# EAGLE design usbtin (EAGLE 9.4.2)
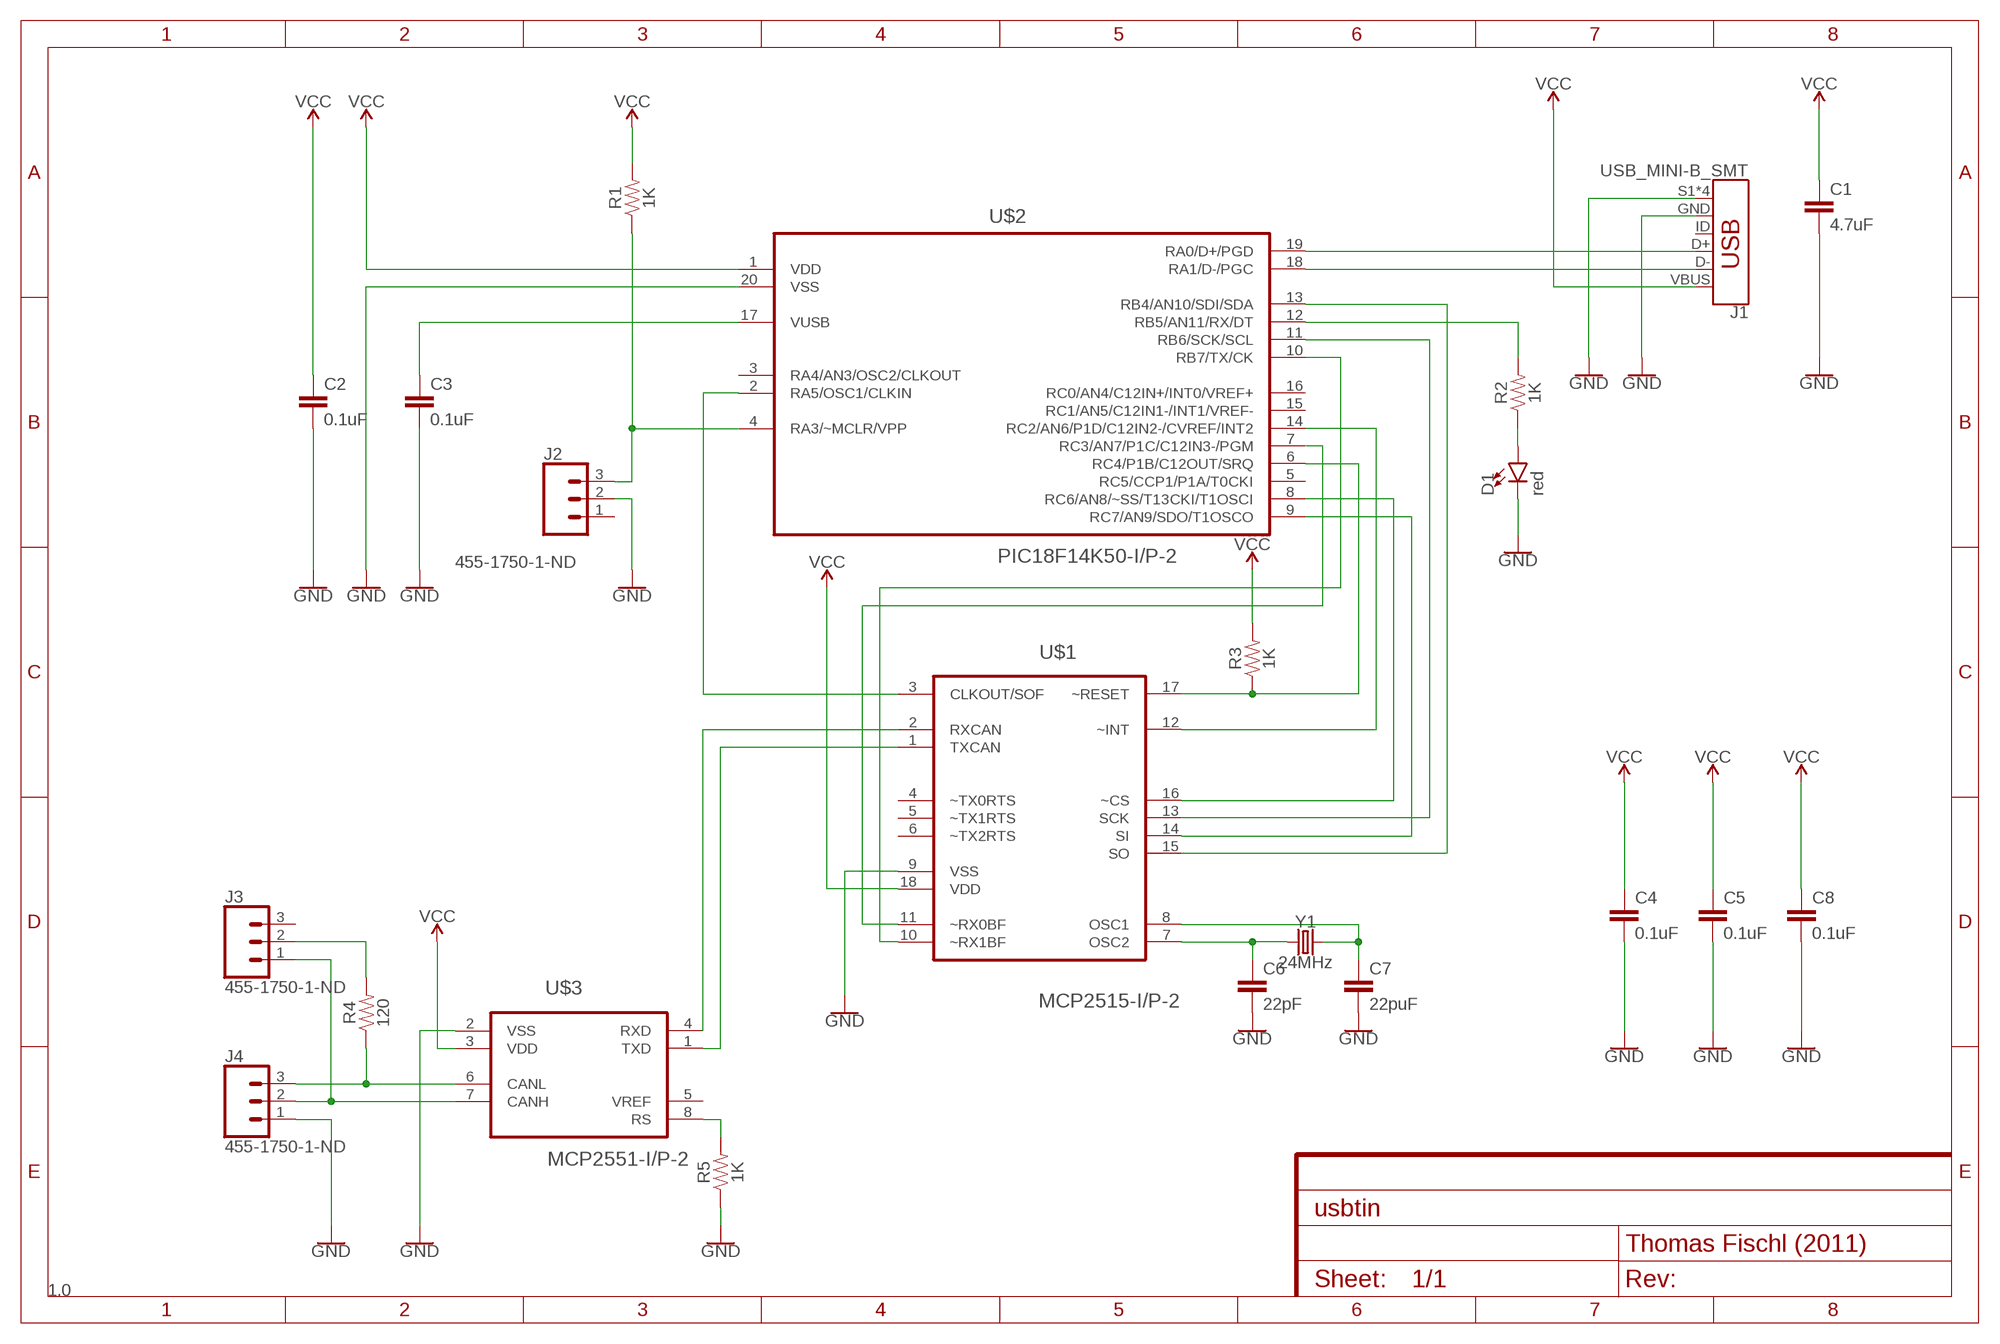
[diagram p0: schematic, sheet 1]
FRAME1 (FRAME-A4L): DESIGNER: Thomas Fischl (2011); REV: 1.0

## Parts
C1  4.7uF  4.7UF-1206-16V-(+80/-20%)  [1206]
C2  0.1uF  0.1UF-0603-25V-5%  [0603]
C3  0.1uF  0.1UF-0603-25V-5%  [0603]
C4  0.1uF  0.1UF-0603-25V-5%  [0603]
C5  0.1uF  0.1UF-0603-25V-5%  [0603]
C6  22pF  1.0UF-0805-25V-10%  [0805]
C7  22puF  1.0UF-0805-25V-10%  [0805]
C8  0.1uF  0.1UF-0603-25V-5%  [0603]
D1  red  LED1206  [LED-1206]
J1  USB_MINI-B_SMT  [USB-MINIB]
J2  455-1750-1-ND  CONN_03  [1X03]
J3  455-1750-1-ND  CONN_03  [1X03]
J4  455-1750-1-ND  CONN_03  [1X03]
R1  1K  0.3OHM-0805-1/8W-1%  [0805]
R2  1K  0.3OHM-0805-1/8W-1%  [0805]
R3  1K  0.3OHM-0805-1/8W-1%  [0805]
R4  120  0.3OHM-0805-1/8W-1%  [0805]
R5  1K  0.3OHM-0805-1/8W-1%  [0805]
U$1  MCP2515-I/P-2  [DIP254P762X432-18]
U$2  PIC18F14K50-I/P-2  [DIP254P762X533-20]
U$3  MCP2551-I/P-2  [DIP254P762X432-8]
Y1  24MHz  CRYSTALPTH-HC49US  [HC49US]

## Nets
GND: C1.2 C2.2 C3.2 C4.2 C5.2 C6.2 C7.2 C8.2 D1.C J1.GND J1.S1(SHIELD) J1.S2(SHIELD) J1.S3(SHIELD) J1.S4(SHIELD) J2.2 J4.1 R5.1 U$1.9(VSS) U$2.20(VSS) U$3.2(VSS)
N$1: J1.D+ U$2.19(RA0/D+/PGD)
N$2: J1.D- U$2.18(RA1/D-/PGC)
N$3: C3.1 U$2.17(VUSB)
N$4: J2.3 R1.1 U$2.4(RA3/~MCLR/VPP)
N$5: U$1.3(CLKOUT/SOF) U$2.2(RA5/OSC1/CLKIN)
N$6: R2.2 U$2.12(RB5/AN11/RX/DT)
N$7: R3.1 U$1.17(~RESET) U$2.6(RC4/P1B/C12OUT/SRQ)
N$8: U$1.12(~INT) U$2.14(RC2/AN6/P1D/C12IN2-/CVREF/INT2)
N$9: U$1.16(~CS) U$2.8(RC6/AN8/~SS/T13CKI/T1OSCI)
N$10: D1.A R2.1
N$11: U$1.15(SO) U$2.13(RB4/AN10/SDI/SDA)
N$12: U$1.13(SCK) U$2.11(RB6/SCK/SCL)
N$13: U$1.2(RXCAN) U$3.4(RXD)
N$14: U$1.1(TXCAN) U$3.1(TXD)
N$15: R5.2 U$3.8(RS)
N$16: C7.1 U$1.8(OSC1) Y1.2
N$17: C6.1 U$1.7(OSC2) Y1.1
N$18: U$1.11(~RX0BF) U$2.7(RC3/AN7/P1C/C12IN3-/PGM)
N$19: U$1.10(~RX1BF) U$2.10(RB7/TX/CK)
N$20: J3.2 R4.2
N$21: J3.1 J4.2 U$3.7(CANH)
N$22: J4.3 R4.1 U$3.6(CANL)
N$23: U$1.14(SI) U$2.9(RC7/AN9/SDO/T1OSCO)
VCC: C1.1 C2.1 C4.1 C5.1 C8.1 J1.VBUS R1.2 R3.2 U$1.18(VDD) U$2.1(VDD) U$3.3(VDD)
Unconnected: J1.ID J2.1 J3.3 U$1.4(~TX0RTS) U$1.5(~TX1RTS) U$1.6(~TX2RTS) U$2.3(RA4/AN3/OSC2/CLKOUT) U$2.5(RC5/CCP1/P1A/T0CKI) U$2.15(RC1/AN5/C12IN1-/INT1/VREF-) U$2.16(RC0/AN4/C12IN+/INT0/VREF+) U$3.5(VREF)

## Library data of the parts
C1 = SparkFun-Capacitors:4.7UF: 4.7µF ceramic capacitors A capacitor is a passive two-terminal electrical component used to store electrical energy temporarily in an electric field.; PROD_ID: CAP-10300
C2-C5 C8 = SparkFun-Capacitors:0.1UF: 0.1µF ceramic capacitors A capacitor is a passive two-terminal electrical component used to store electrical energy temporarily in an electric field.; PROD_ID: CAP-08604
C6 C7 = SparkFun-Capacitors:1.0UF: 1µF ceramic capacitors A capacitor is a passive two-terminal electrical component used to store electrical energy temporarily in an electric field.; PROD_ID: CAP-08064; VALUE: 1.0uF
D1 = SparkFun-LED:LED: LED (Generic) Standard schematic elements and footprints for 5mm, 3mm, 1206, and 0603 sized LEDs. Generic LEDs with no color specified.
J1 = SparkFun-Connectors:USB_MINI-B: USB type Mini-B Connector Breaks out 5th pin, and includes shield pins if needed. SparkFun Products: SparkFun FTDI Basic Breakout <https://www.sparkfun.com/products/9716> SparkFun XBee Explorer USB <https://www.sparkfun.com/products/11812> SparkFun Redboard <https://www.sparkfun.com/products/12757>; PROD_ID: CONN-08193; SF_ID: PRT-00587
J2-J4 = SparkFun-Connectors:CONN_03: Multi connection point. Often used as Generic Header-pin footprint for 0.1 inch spaced/style header connections On any of the 0.1 inch spaced packages, you can populate with these: Break Away Headers - Straight <https://www.sparkfun.com/products/116> (PRT-00116) Break Away Male Headers - Right Angle <https://www.sparkfun.com/products/553> (PRT-00553) Female Headers <https://www.sparkfun.com/products/115> (PRT-00115) Break Away Headers - Machine Pin <https://www.sparkfun.com/products/117> (PRT-00117) Break Away Female Headers - Swiss Machine Pin <https://www.sparkfun.com/products/743> (PRT-00743) Stackable Header - 3 Pin (Female, 0.1") <https://www.sparkfun.com/products/13875> (PRT-13875) For SCREWTERMINALS and SPRING TERMINALS visit here: Screw Terimnals on SparkFun.com <https://www.sparkfun.com/search/results?term=Screw+Terminals> (5mm/3.5mm/2.54mm spacing) This device is also useful as a general connection point to wire up your design to another part of your project. Our various solder wires solder well into these plated through hole pads. Hook-Up Wire - Assortment (Stranded, 22 AWG) <https://www.sparkfun.com/products/11375> (PRT-11375) Hook-Up Wire - Assortment (Solid Core, 22 AWG) <https://www.sparkfun.com/products/11367> (PRT-11367) View the entire wire category on our website here <https://www.sparkfun.com/categories/141> Special notes: Molex polarized connector foot print use with SKU : PRT-08232 with associated crimp pins and housings.; PROD_ID: XXX-00000
R1-R5 = SparkFun-Resistors:0.3OHM: 0.3Ω resistor A resistor is a passive two-terminal electrical component that implements electrical resistance as a circuit element. Resistors act to reduce current flow, and, at the same time, act to lower voltage levels within circuits. - Wikipedia; PROD_ID: RES-11622; VALUE: 0.3
U$1 = Microchip_By_element14_Batch_1:MCP2515-I/P-2: Stand-Alone CAN Controller; DESCRIPTION: CAN CONTRL; MPN: MCP2515-I/P; OC_FARNELL: 1439391; OC_NEWARK: 61K2945; PACKAGE: PDIP-18; SUPPLIER: MICROCHIP
U$2 = Microchip_By_element14_Batch_1:PIC18F14K50-I/P-2: USB Flash Microcontrollers; MPN: PIC18F14K50-I/P; OC_FARNELL: 1648501; OC_NEWARK: 77M3103; PACKAGE: DIP-20; SUPPLIER: Microchip
U$3 = Microchip_By_element14_Batch_1:MCP2551-I/P-2: High-Speed CAN Transceiver; DESCRIPTION: CAN CTRL; MPN: MCP2551-I/P; OC_FARNELL: 1292240; OC_NEWARK: 61K2947; PACKAGE: PDIP-8; SUPPLIER: Microchip
Y1 = SparkFun-Clocks:CRYSTAL: Crystals (Generic) These are passive quartz crystals, which can be used as a clock source for a microcontroller. Crystal's are two-terminal devices. They require external "load" capacitors to generate an oscillating signal.

## Board
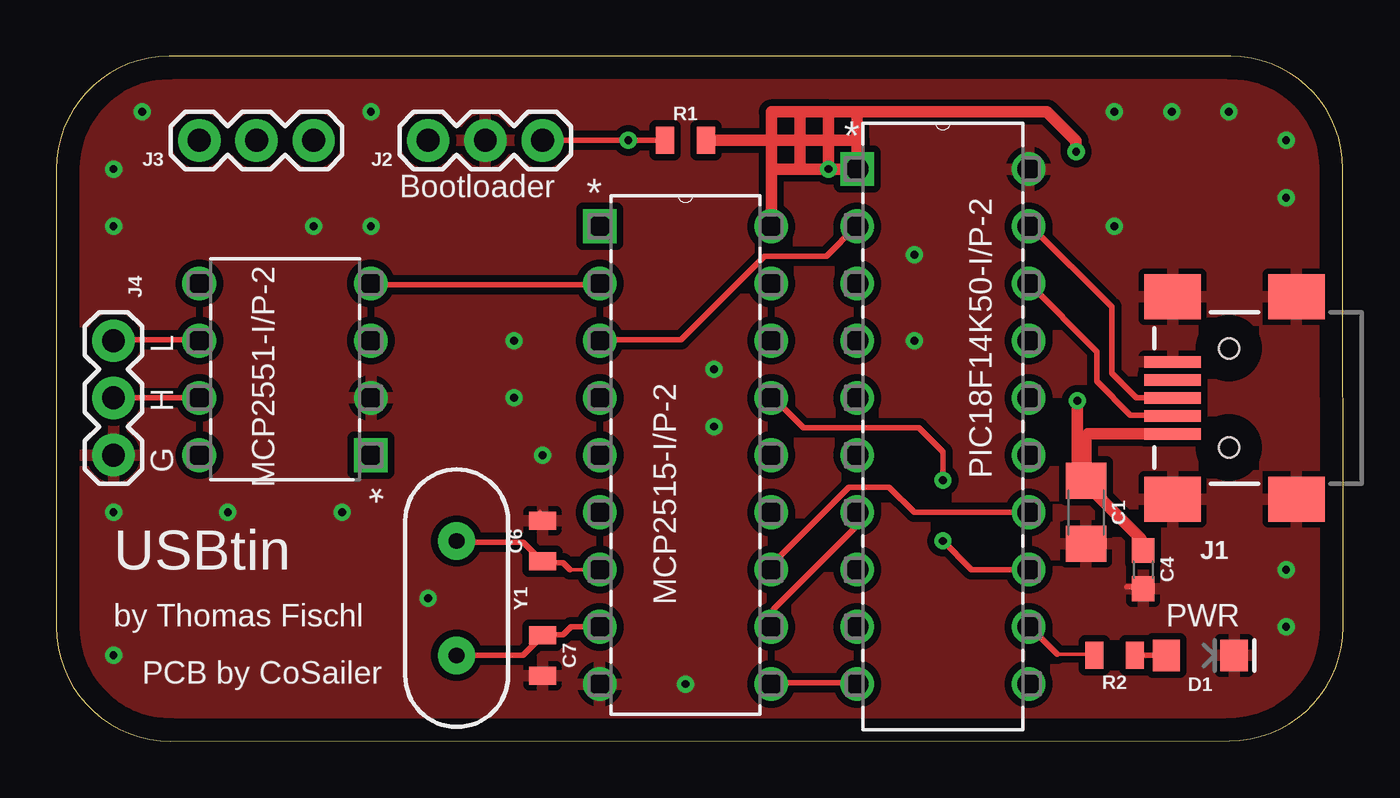
[diagram p1: board, top side]
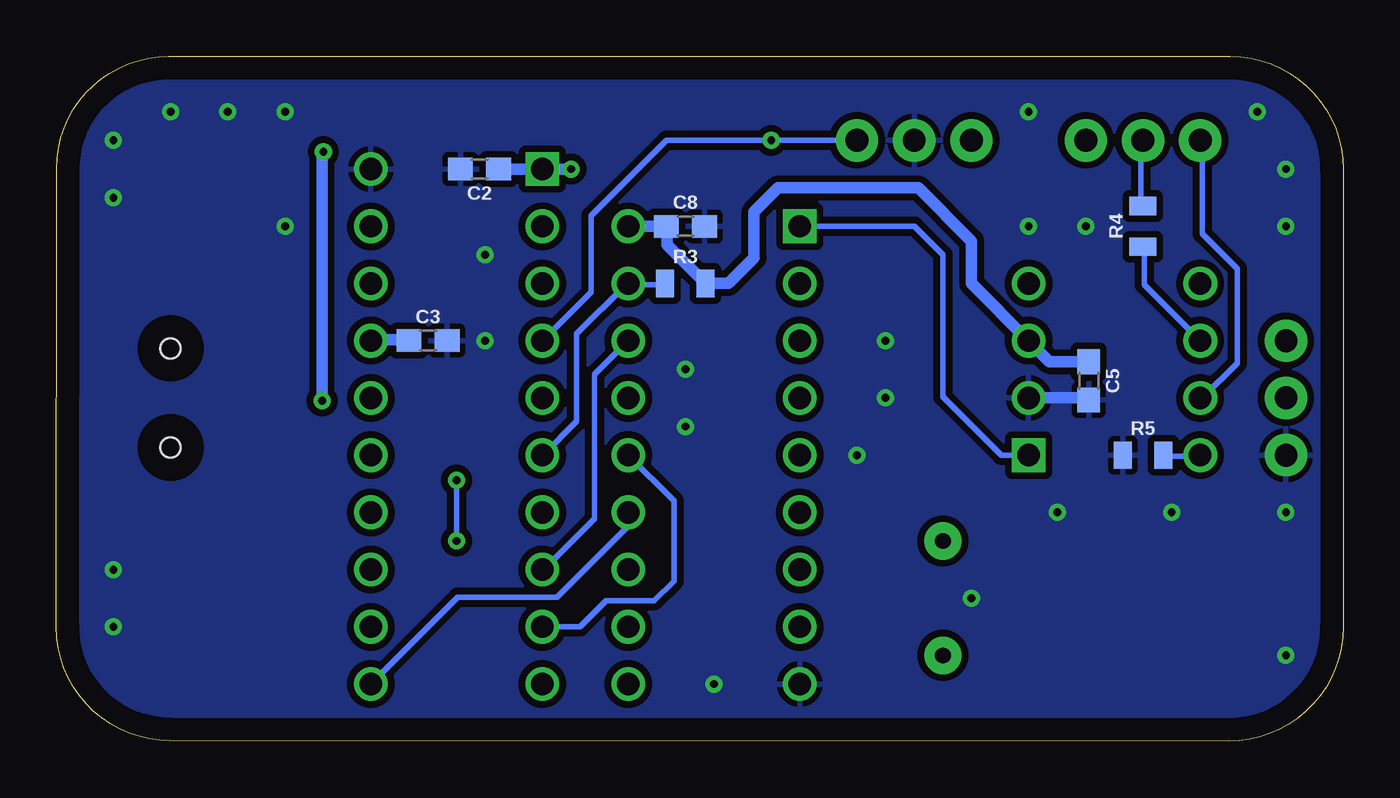
[diagram p2: board, bottom side, seen from below]

Size 57.15 x 30.4 mm. Coordinates in mm from the lower left corner, seen from the top.
Outline: 52.15,30.4 5,30.4 arc90 0,25.4 0,5.08 arc90 5.08,0 52.09,0.02 arc90 57.15,5.08 57.13,25.42 arc90 52.15,30.4
Copper layers (1*16): Top 0.035mm / dielectric 1.5mm / Bottom 0.035mm
Design rules "default": minimum track width 6mil, minimum drill 0.35mm, track to track 6mil, track to pad 6mil, pad to pad 6mil, via to via 6mil, smd to smd 6mil, copper to edge 40mil, drill to drill 6mil, minimum pad ring 10mil, minimum via ring 8mil, stop-mask expansion 4mil, vias tented up to drill 0mil, thermal gap 10mil

### Footprints (pad centres in the part's own frame; a part is rotated, then mirrored left to right if it is on the bottom)
1206 = smd 1.6 x 1.8: 1 -1.4,0; 2 1.4,0
0603 = smd 1.1 x 1: 1 -0.85,0; 2 0.85,0
0805 = smd 0.8 x 1.2: 1 -0.9,0; 2 0.9,0
LED-1206 = smd 1.2 x 1.4: A -1.5,0; C 1.5,0
USB-MINIB = smd 2.5 x 0.5: D+ 2.5,0; D- 2.5,0.8; GND 2.5,-1.6; ID 2.5,-0.8; VBUS 2.5,1.6 | smd 2.5 x 2: S1 -3,4.5; S2 2.5,4.5; S3 -3,-4.5; S4 2.5,-4.5 | hole 0.9: 0,2.2; 0,-2.2
1X03 = drill 1.016 pad 1.88: 1 0,0; 2 2.54,0; 3 5.08,0
DIP254P762X432-18 = drill 0.991 square: 1 -7.62,20.32 | drill 0.991: 2 -7.62,17.78; 3 -7.62,15.24; 4 -7.62,12.7; 5 -7.62,10.16; 6 -7.62,7.62; 7 -7.62,5.08; 8 -7.62,2.54; 9 -7.62,0; 10 0,0; 11 0,2.54; 12 0,5.08; 13 0,7.62; 14 0,10.16; 15 0,12.7; 16 0,15.24; 17 0,17.78; 18 0,20.32
DIP254P762X533-20 = drill 0.991 square: 1 -7.62,22.86 | drill 0.991: 2 -7.62,20.32; 3 -7.62,17.78; 4 -7.62,15.24; 5 -7.62,12.7; 6 -7.62,10.16; 7 -7.62,7.62; 8 -7.62,5.08; 9 -7.62,2.54; 10 -7.62,0; 11 0,0; 12 0,2.54; 13 0,5.08; 14 0,7.62; 15 0,10.16; 16 0,12.7; 17 0,15.24; 18 0,17.78; 19 0,20.32; 20 0,22.86
DIP254P762X432-8 = drill 0.991 square: 1 -7.62,7.62 | drill 0.991: 2 -7.62,5.08; 3 -7.62,2.54; 4 -7.62,0; 5 0,0; 6 0,2.54; 7 0,5.08; 8 0,7.62
HC49US = drill 0.7 pad 1.651: 1 -2.54,0; 2 2.54,0

### Placement (x,y rotation side)
C1  45.72,10.16 270 top
C2  38.35,25.4 180 bottom
C3  40.64,17.78 0 bottom
C4  48.26,7.62 270 top
C5  11.3,16 270 bottom
C6  21.59,8.89 90 top
C7  21.59,3.81 270 top
C8  29.21,22.86 0 bottom
D1  50.8,3.81 0 top
J1  52.07,15.24 180 top
J2  16.51,26.67 0 top
J3  6.35,26.67 0 top
J4  2.54,12.7 90 top
R1  27.94,26.67 0 top
R2  46.99,3.81 180 top
R3  29.21,20.32 0 bottom
R4  8.89,22.86 90 bottom
R5  8.89,12.7 0 bottom
U$1  31.75,2.54 0 top
U$2  43.18,2.54 0 top
U$3  6.35,20.32 180 top
Y1  17.78,6.35 270 top

### Tracks (layer width: path | path; a pad name or v marks a point on that pad's centre or on a via)
GND  (via drill 0.35)
  Top 0.152: 48.16,6.86 C4.2 | 49.53,10.67 J1.S2 | 21.64,2.89 C7.2 | 21.64,9.75 C6.2 21.49,9.9 21.49,10.21 | 45.72,8.68 C1.2
  Top 0.254: 47.55,6.86 48.16,6.86
  Bottom 0.254: 27.94,22.86 C8.2
  Bottom 0.508: C5.2 11.39,15.24 U$3.2
  other vias: 2.54,3.81 2.54,10.16 7.62,10.16 12.7,10.16 16.51,6.35 3.81,27.94 2.54,25.4 2.54,22.86 11.43,22.86 13.97,22.86 13.97,27.94 54.61,24.13 20.32,17.78 20.32,15.24 21.59,12.7 54.61,26.67 52.07,27.94 49.53,27.94 46.99,27.94 46.99,22.86 29.21,16.51 38.1,21.59 38.1,17.78 29.21,13.97 54.61,7.62 54.61,5.08 27.94,2.54
  pour Top (isolate 0.305): 0,31.75 0,0 57.15,0 57.15,31.75
  pour Bottom (isolate 0.305): -1.27,30.48 -1.27,0 57.15,0 57.15,30.48
N$1
  Top 0.152: 43.28,22.86 U$2.19
  Top 0.254: J1.D+ 47.95,15.24 46.86,16.33 46.86,19.28 43.28,22.86
N$2
  Top 0.152: 49.53,14.48 J1.D-
  Top 0.254: 49.53,14.48 47.7,14.48 46.2,15.97 46.2,17.29 U$2.18
N$3
  Bottom 0.152: 41.61,17.83 C3.1 | 43.13,17.83 U$2.17
  Bottom 0.508: 43.13,17.83 41.61,17.83
N$4  (via drill 0.35)
  Top 0.254: v25.4,26.67 26.67,26.67 | v25.4,26.67 R1.1 | J2.3 v25.4,26.67
  Bottom 0.254: U$2.4 33.4,19.94 33.4,23.31 30.05,26.67 J2.3
N$5
  Top 0.152: 24.23,17.83 U$1.3 | 35.51,22.86 U$2.2
  Top 0.254: 24.23,17.83 27.74,17.83 31.45,21.54 34.19,21.54 35.51,22.86
N$6
  Top 0.152: R2.2 46.04,3.86 44.45,3.86 | 43.28,5.03 U$2.12
  Top 0.254: 43.28,5.03 44.45,3.86
N$7
  Bottom 0.152: 30.17,20.27 R3.1 | 31.7,20.27 U$1.17 31.85,20.27
  Bottom 0.254: 31.7,20.27 30.17,20.27 | U$2.6 35.54,12.7 34.04,14.2 34.04,18.08 31.85,20.27
N$8
  Top 0.152: 31.85,7.92 31.85,7.62 U$1.12
  Top 0.254: 31.85,7.92 35.2,11.28 36.98,11.28 38.1,10.16 U$2.14
N$9
  Bottom 0.152: 35.51,7.62 U$2.8
  Bottom 0.254: 35.51,7.62 33.25,9.88 33.25,16.28 U$1.16
N$10
  Top 0.254: R2.1 D1.A
N$11  (via drill 0.35)
  Top 0.152: 31.85,15.24 U$1.15
  Top 0.254: v39.37,11.58 39.37,12.85 38.3,13.92 33.17,13.92 31.85,15.24 | U$2.13 40.64,7.62 v39.37,8.89
  Bottom 0.254: v39.37,11.58 v39.37,8.89
N$12
  Bottom 0.254: U$1.13 31.75,9.55 34.9,6.4 39.32,6.4 U$2.11
N$13
  Top 0.152: 14.02,20.27 U$3.4 | 24.08,20.27 U$1.2
  Top 0.254: 24.08,20.27 14.02,20.27
N$14
  Bottom 0.254: U$1.1 19.05,22.86 17.78,21.59 17.78,15.29 15.19,12.7 U$3.1
N$15
  Bottom 0.152: 7.92,12.65 R5.2 | 6.4,12.65 U$3.8
  Bottom 0.254: 6.4,12.65 7.92,12.65
N$16
  Top 0.152: 21.64,4.72 C7.1 21.49,4.57
  Top 0.254: 21.64,4.72 22.5,4.72 22.86,5.08 U$1.8 | Y1.2 20.73,3.81 21.49,4.57
N$17
  Top 0.152: 21.64,7.92 C6.1 21.49,8.07 | 22.81,7.62 U$1.7 | 17.83,8.84 Y1.1
  Top 0.254: 21.64,7.92 22.5,7.92 22.81,7.62 | 17.83,8.84 20.73,8.84 21.49,8.07
N$18
  Top 0.152: 31.85,5.18 U$1.11 | 35.56,9.57 U$2.7
  Top 0.254: 31.85,5.18 31.85,5.86 34.58,8.6 35.56,9.57
N$19
  Top 0.152: 31.85,2.59 U$1.10 | 35.51,2.59 U$2.10
  Top 0.254: 35.51,2.59 31.85,2.59
N$20
  Bottom 0.152: 8.99,23.77 R4.2 | 8.99,26.67 J3.2
  Bottom 0.254: 8.99,26.67 8.99,23.77
N$21
  Top 0.254: J4.2 U$3.7
  Bottom 0.152: 6.25,26.67 J3.1 | 6.25,15.24 U$3.7
  Bottom 0.254: 6.25,26.67 6.25,22.53 4.7,20.98 4.7,16.79 6.25,15.24
N$22
  Top 0.152: 2.59,17.83 J4.3 | 6.25,17.83 U$3.6
  Top 0.254: 6.25,17.83 2.59,17.83
  Bottom 0.152: 8.84,21.94 R4.1
  Bottom 0.254: 8.84,21.94 8.84,20.27 U$3.6
N$23
  Bottom 0.254: U$2.9 33.89,5.08 32.74,6.23 30.59,6.23 29.72,7.11 29.72,10.67 U$1.14
VCC  (via drill 0.35)
  Top 0.152: 48.16,8.99 48.16,8.53 C4.1 | 45.72,11.43 C1.1
  Top 0.254: 45.8,13.64 45.72,13.56
  Top 0.508: 45.72,11.43 48.16,8.99 | 45.72,13.56 C1.1 45.34,11.94 v45.34,15.11 | J1.VBUS 45.8,13.64 | v34.29,25.4 U$2.1 35.56,27.86 | v34.29,25.4 33.02,25.4 | 33.02,25.4 31.75,25.4 | 31.75,25.4 31.75,26.67 | 31.75,26.67 31.75,27.94 33.02,27.94 | U$1.18 31.75,25.4 | 34.29,27.94 44,27.94 45.29,26.65 v45.29,26.16 | 34.29,27.94 33.02,27.94 | 34.29,27.94 v34.29,25.4 | 33.02,27.94 33.02,25.4 | 31.75,26.67 35.56,26.67 | R1.2 31.75,26.67
  Bottom 0.152: 30.02,22.86 C8.1
  Bottom 0.508: U$1.18 C8.1 | C2.1 v34.29,25.4 | v45.29,26.16 45.34,26.11 v45.34,15.11 | 30.02,22.86 30.02,22.03 R3.2 27.31,20.32 26.16,21.46 26.16,23.49 25.09,24.56 18.87,24.56 16.51,22.2 16.51,20.32 U$3.3 13.04,16.85 C5.1

### Text on the board
tPlace: Bootloader | G H L | USBtin | by Thomas Fischl | PWR | PCB by CoSailer